# EasyEDA schematic Modulo FTDI FT232.json
TITLE: Sheet_1; REV: 1.0; Date: 2020-01-03; Sheet: 1/1; Drawn By: feliphegomez; Company: Your Company
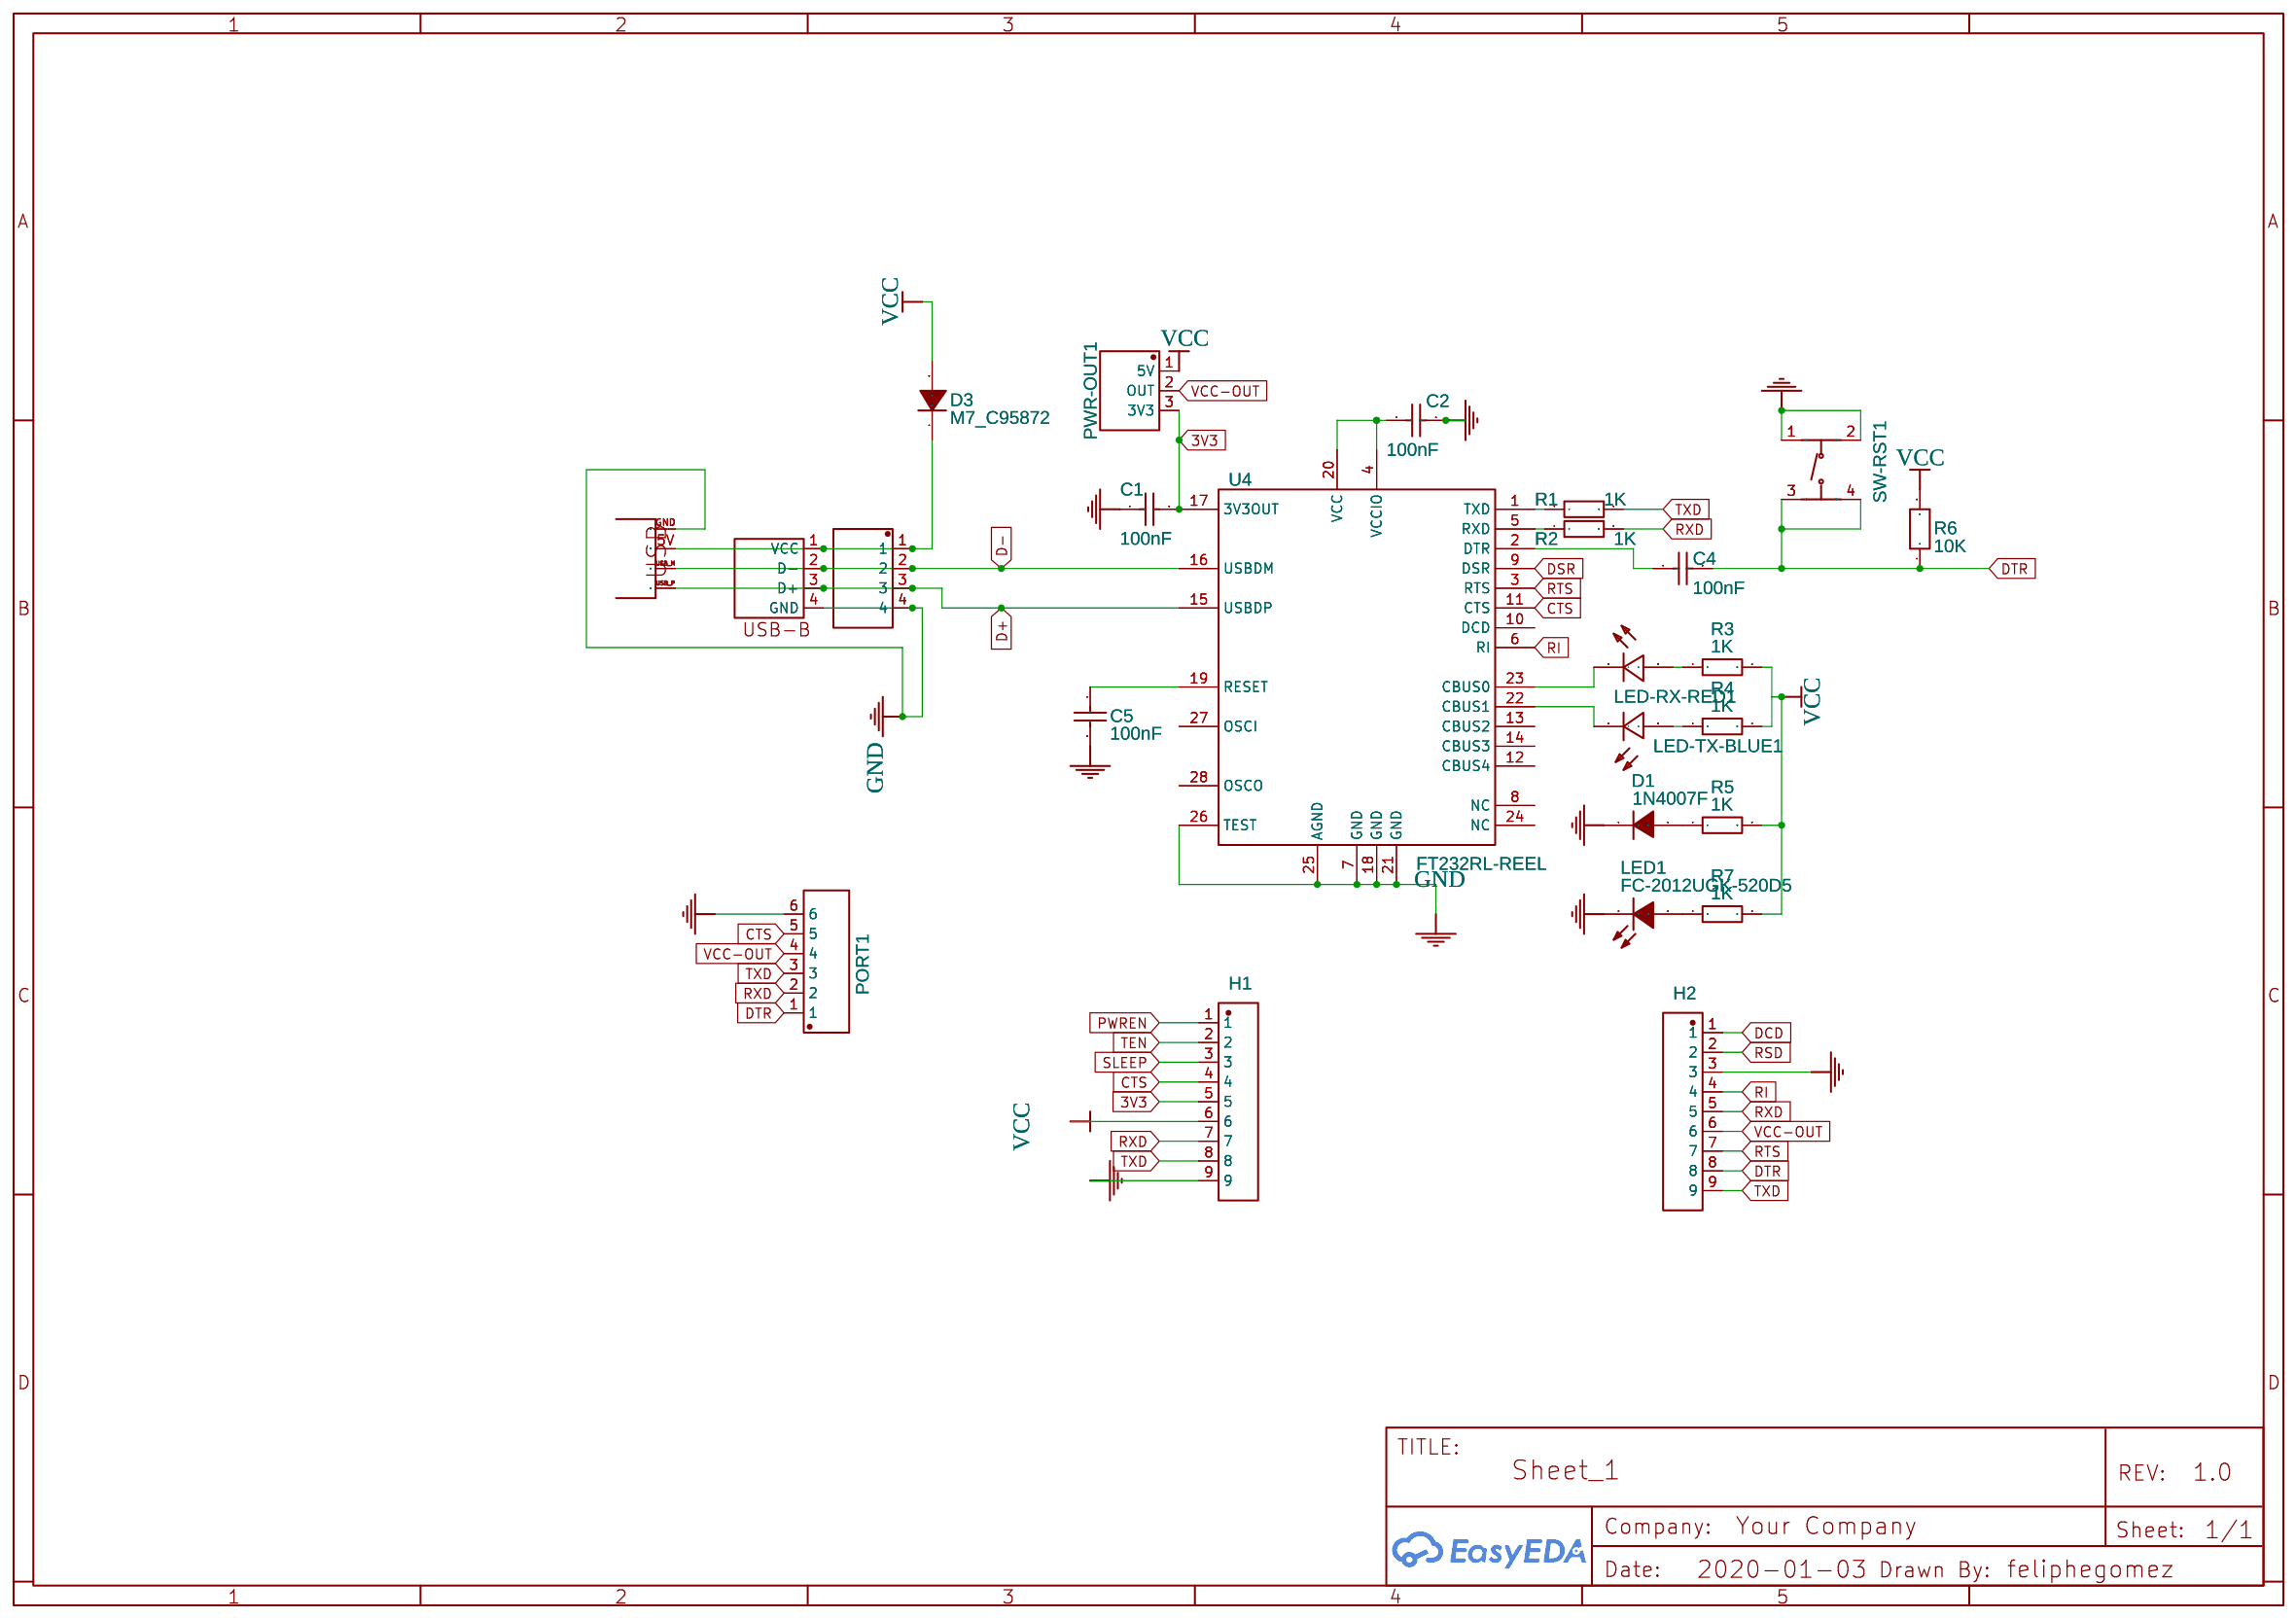
[diagram p0: schematic sheet]

## Parts
#1  -
C1  100nF  [0805]
C2  100nF  [0805]
C4  100nF  [0805]
C5  100nF  [0805]
D1  1N4007F  [SMAF_L3.5-W2.6-LS4.7-RD]
D3  M7_C95872  [DO-214AC_L4.3-W2.7-LS5.3-RD]
H1  A2541WV-9P  [HDR-TH_9P-P2.54-V]
H2  A2541WV-9P  [HDR-TH_9P-P2.54-V]
JP1  USBPCB  [USB-A-PCB]
LED1  FC-2012UGK-520D5  [LED0805-FD]
LED-RX-RED1  E6C0805URAC1UDA  [LED0805-R-RD]
LED-TX-BLUE1  E6C0805QBAC1UDA  [LED0805-R-RD]
PORT1  220S-1*6P H=8.5MM Ytype Gold-plated  [DIP-1X6P2.54]
PWR-OUT1  210S-1*3P L=11.6MMGold-plated black  [210S-1X3P]
R1  1K  [0805]
R2  1K  [0805]
R3  1K  [0805]
R4  1K  [0805]
R5  1K  [0805]
R6  10K  [RES_0805]
R7  1K  [0805]
SW-RST1  TS-1187A-C-E-B  [SW-SMD_4P-L5.1-W5.1-P3.70-LS6.4]
U4  FT232RL-REEL  [SSOP-28_L10.2-W5.3-P0.65-LS7.8-BL]
USB1  USB-BType interface female 180°  [USB-B-1]
USB-PIN1  Header-Male-2.54_1x4_C124378  [HDR-TH_4P-P2.54-V]

## Library data of the parts
#1 = -: BOM_Manufacturer Part: ?
C1 C2 C4 C5 = CL21B104JBCNNNC: Supplier: LCSC; Manufacturer: SAMSUNG; Supplier Part: C62912; LCSC Assembly: Yes; SMT Type: Extend
D1 = -: Supplier: LCSC; Manufacturer: SK; Supplier Part: C110856; LCSC Assembly: Yes; SMT Type: Extend
D3 = -: Supplier: LCSC; Manufacturer: MDD; Manufacturer Part: M7; LCSC Assembly: Yes; Supplier Part: C95872; SMT Type: Basic
H1 H2 = -: Supplier: LCSC; Supplier Part: C225484; Manufacturer: Changjiang Connectors; Contributor: LCSC
JP1 = -: USB Connectors; Contributor: SparkFun
LED1 = -: Supplier: LCSC; Manufacturer: NATIONSTAR; Supplier Part: C84260; LCSC Assembly: Yes; SMT Type: Extend
LED-RX-RED1 = -: Supplier: LCSC; Supplier Part: C375451; Manufacturer: EKINGLUX; Contributor: LCSC
LED-TX-BLUE1 = -: Supplier: LCSC; Supplier Part: C375453; Manufacturer: EKINGLUX; Contributor: LCSC
PORT1 = -: Supplier: LCSC; Manufacturer: Ckmtw; Contributor: LCSC; Supplier Part: C124415
PWR-OUT1 = -: Supplier: LCSC; Manufacturer: Ckmtw; Contributor: LCSC; Supplier Part: C124376
R1-R5 R7 = 0805W8F1001T5E: Supplier: LCSC; Manufacturer: UniOhm; LCSC Assembly: Yes; Supplier Part: C17513; SMT Type: Basic
R6 = TC0525B1002T5E_C48369: Supplier: LCSC; Supplier Part: C48369; Manufacturer: Uniroyal Elec; Manufacturer Part: TC0525B1002T5E; Contributor: LCSC
SW-RST1 = -: Supplier: LCSC; Supplier Part: C318887; Manufacturer: XKB Enterprise; Contributor: LCSC
U4 = -: Supplier: LCSC; Manufacturer: FTDI; LCSC Assembly: Yes; image: //image.lceda.cn/szlcsc/C8690.jpg; Supplier Part: C8690; SMT Type: Basic
USB1 = -: Supplier: LCSC; Supplier Part: C26234
USB-PIN1 = -: Supplier: LCSC; Manufacturer: Ckmtw; Manufacturer Part: 210S-1*4P L=11.6MMGold-plated black; Contributor: LCSC; Supplier Part: C124378

## Nets
3V3: C1.2 H1.5 PWR-OUT1.3(3V3) U4.17(3V3OUT)
GND: C1.1 C2.2 C5.2 D1.1(C) H1.9 H2.3 JP1.GND LED1.2(K) PORT1.6 SW-RST1.1(A) SW-RST1.2(B) U4.7(GND) U4.18(GND) U4.21(GND) U4.25(AGND) U4.26(TEST) USB1.4(GND) USB-PIN1.4
VCC: D3.2(A) H1.6 PWR-OUT1.1(5V) R3.2 R4.2 R5.2 R6.2 R7.2
VCC-OUT: H2.6 PORT1.4 PWR-OUT1.2(OUT)
CTS: H1.4 PORT1.5 U4.11(CTS)
D+: JP1.USB_P(D+) U4.15(USBDP) USB1.3(D+) USB-PIN1.3
D-: JP1.USB_M(D-) U4.16(USBDM) USB1.2(D-) USB-PIN1.2
DCD: H2.1
DSR: U4.9(DSR)
DTR: C4.2 H2.8 PORT1.1 R6.1 SW-RST1.3(C) SW-RST1.4(D)
PWREN: H1.1
RI: H2.4 U4.6(RI)
RSD: H2.2
RTS: H2.7 U4.3(RTS)
RXD: H1.7 H2.5 PORT1.2 R2.2
SLEEP: H1.3
TEN: H1.2
TXD: H1.8 H2.9 PORT1.3 R1.2
Net-(C2-1): C2.1 U4.4(VCCIO) U4.20(VCC)
Net-(C4-1): C4.1 U4.2(DTR)
Net-(C5-1): C5.1 U4.19(RESET)
Net-(D1-2): D1.2(A) R5.1
Net-(D3-1): D3.1(K) JP1.5V(VBUS) USB1.1(VCC) USB-PIN1.1
Net-(LED1-1): LED1.1(A) R7.1
Net-(LED-RX-RED1-1): LED-RX-RED1.1(+) R3.1
Net-(LED-RX-RED1-2): LED-RX-RED1.2(-) U4.23(CBUS0)
Net-(LED-TX-BLUE1-1): LED-TX-BLUE1.1(+) R4.1
Net-(LED-TX-BLUE1-2): LED-TX-BLUE1.2(-) U4.22(CBUS1)
Net-(R1-1): R1.1 U4.1(TXD)
Net-(R2-1): R2.1 U4.5(RXD)

Not connected (* = marked no-connect by the designer): U4 8(NC) 10(DCD) 12(CBUS4) 13(CBUS2) 14(CBUS3) 24(NC) 27(OSCI) 28(OSCO)
